# EasyEDA Pro project 2轴4.0--(02-06).eprj, schematic 2轴4.0-
Board Name: 2轴4.0-; Create Date: 2025-02-05; Page Name: 2轴4.0-; Project Name: 2轴4.0--0206; Schematic Name: 2轴4.0-; Update Date: 2025-02-06; Company: 嘉立创EDA; Page Size: A2; Version: V1.0
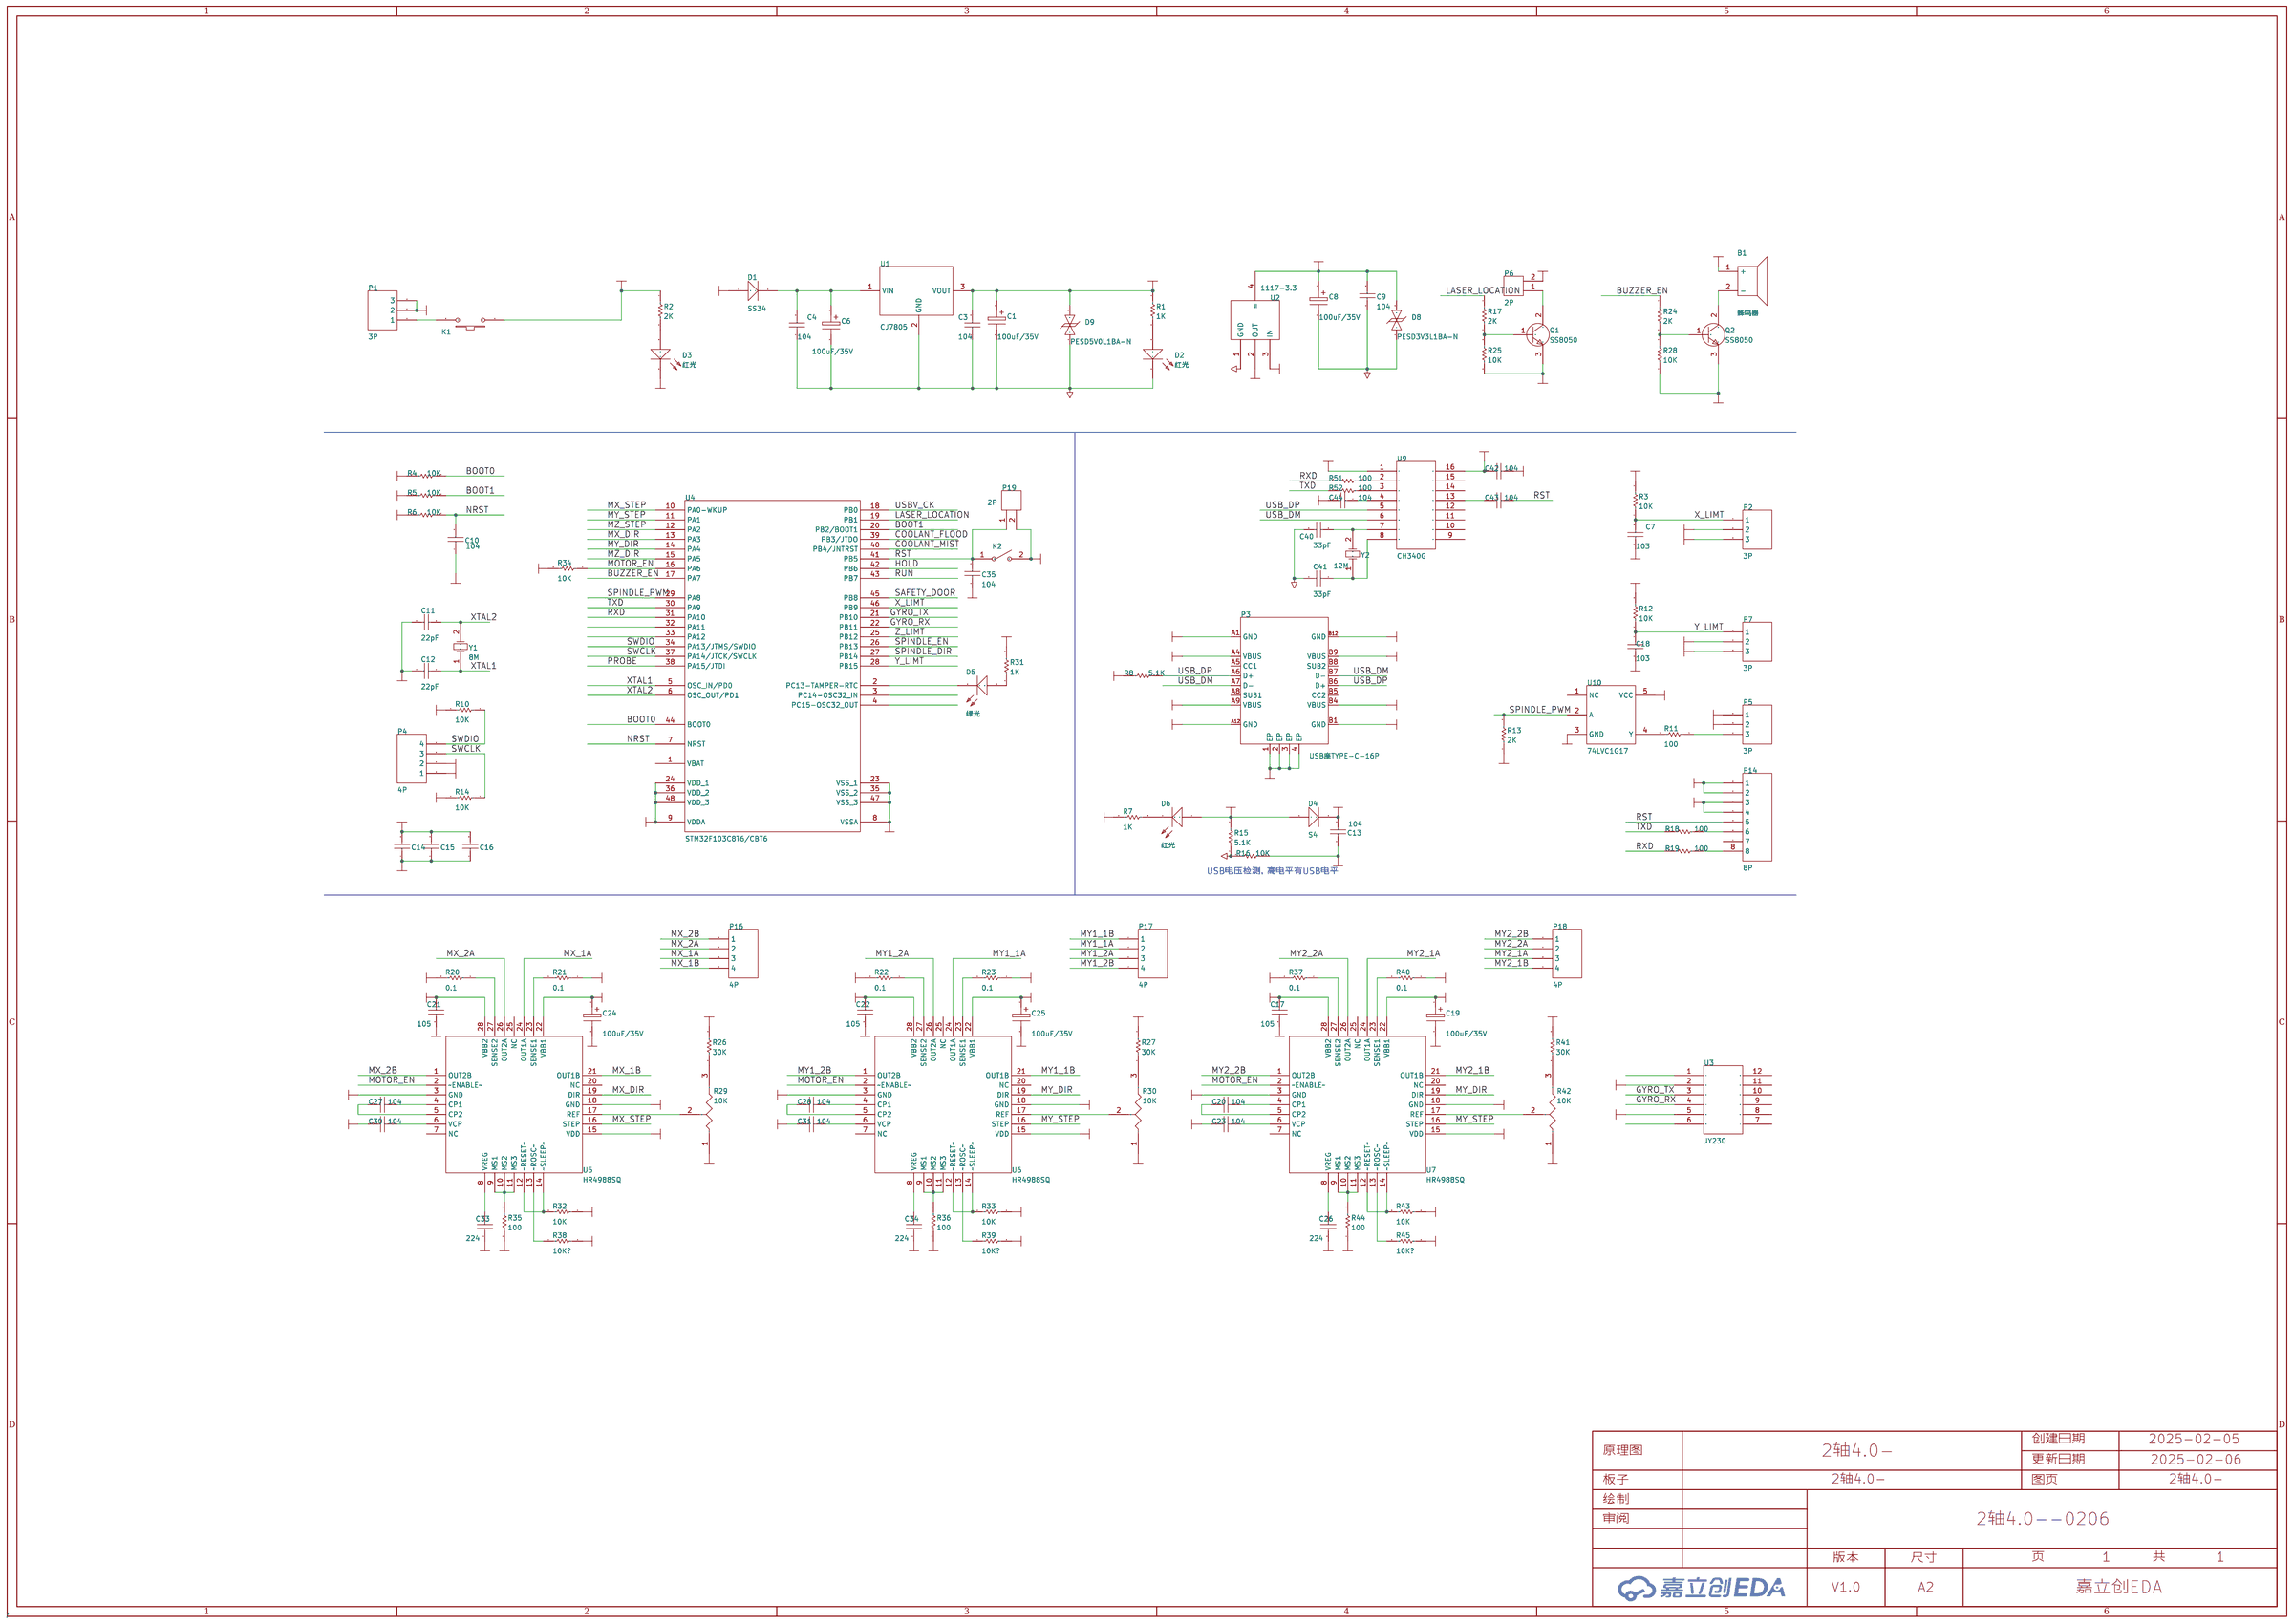
[diagram p0: schematic sheet]

## Parts
B1  蜂鸣器  [蜂鸣器9]
C1  100uF/35V  [电解电容贴片6X6]
C3  104  [0603C]
C4  104  [0603C]
C6  100uF/35V  [电解电容贴片6X6]
C7  103  [0603C]
C8  100uF/35V  [电解电容贴片6X6]
C9  104  [0603C]
C10  104  [0603C]
C11  100pF  [0603C]
C12  100pF  [0603C]
C13  104  [0603C]
C14  104  [0603C]
C15  104  [0603C]
C16  104  [0603C]
C17  105  [0805C]
C18  103  [0603C]
C19  100uF/35V  [电解电容贴片6X6]
C20  104  [0603C]
C21  105  [0805C]
C22  105  [0805C]
C23  104  [0603C]
C24  100uF/35V  [电解电容贴片6X6]
C25  100uF/35V  [电解电容贴片6X6]
C26  224  [0603C]
C27  104  [0603C]
C28  104  [0603C]
C30  104  [0603C]
C31  104  [0603C]
C33  224  [0603C]
C34  224  [0603C]
C35  104  [0603C]
C40  18pF  [0603C]
C41  18pF  [0603C]
C42  104  [0603C]
C43  104  [0603C]
C44  104  [0603C]
D1  SS34  [SMA]
D2  红光  [0603LED]
D3  红光  [0603LED]
D4  S4  [SOD-123]
D5  绿光  [0603LED]
D6  红光  [0603LED]
D8  PESD3V3L1BA-N  [SOD-523_L1.2-W0.8-LS1.6-BI]
D9  PESD5V0L1BA-N  [SOD-523_L1.2-W0.8-LS1.6-BI]
K1  按键  [按键18X13]
K2  开关  [按键6X6贴片]
P1  3P  [DC0044A]
P2  3P  [HDR1X3_P]
P3  USB座TYPE-C-16P  [USB-TYPE-C-16P]
P4  4P  [SIP4]
P5  3P  [HDR1X3_P]
P6  2P  [HDR1X2_P]
P7  3P  [HDR1X3_P]
P14  8P  [IDC8弯脚]
P16  4P  [HDR1X4_P]
P17  4P  [HDR1X4_P]
P18  4P  [HDR1X4_P]
P19  2P  [HDR1X2_P]
Q1  SS8050  [SOT-23]
Q2  SS8050  [SOT-23]
R1  1K  [0603R]
R2  2K  [0603R]
R3  10K  [0603R]
R4  10K  [0603R]
R5  10K  [0603R]
R6  10K  [0603R]
R7  1K  [0603R]
R8  5.1K  [0603R]
R10  10K  [0603R]
R11  100  [0603R]
R12  10K  [0603R]
R13  2K  [0603R]
R14  10K  [0603R]
R15  5.1K  [0603R]
R16  10K  [0603R]
R17  2K  [0603R]
R18  100  [0603R]
R19  100  [0603R]
R20  0.1  [0805R]
R21  0.1  [0805R]
R22  0.1  [0805R]
R23  0.1  [0805R]
R24  2K  [0603R]
R25  10K  [0603R]
R26  30K  [0603R]
R27  30K  [0603R]
R28  10K  [0603R]
R29  10K  [松下贴片电位器3X3]
R30  10K  [松下贴片电位器3X3]
R31  1K  [0603R]
R32  10K  [0603R]
R33  10K  [0603R]
R34  10K  [0603R]
R35  100  [0603R]
R36  100  [0603R]
R37  0.1  [0805R]
R38  10K?  [0603R]
R39  10K?  [0603R]
R40  0.1  [0805R]
R41  30K  [0603R]
R42  10K  [松下贴片电位器3X3]
R43  10K  [0603R]
R44  100  [0603R]
R45  10K?  [0603R]
R51  100  [0603R]
R52  100  [0603R]
U1  CJ7805  [TO-263-2]
U2  1117-3.3  [SOT-223]
U3  JY230  [舵螺仪JY-230]
U4  STM32F103C8T6/CBT6  [LQFP48]
U5  HR4988SQ  [QFN28]
U6  HR4988SQ  [QFN28]
U7  HR4988SQ  [QFN28]
U9  CH340G  [SOP16]
U10  74LVC1G17  [SOT-23-5]
Y1  8M  [晶振贴片]
Y2  12M  [晶振贴片49SSMD]

## Library data of the parts
B1 = 蜂鸣器: Library Name: SCH封装库
C1 C6 C8 C19 C24 C25 = 100uF/35V: Origin Footprint 2: X47U; Origin Footprint 1: 电解电容贴片6x6; Design Item ID: ELECTRO1; Library Name: *
C3 C9 C10 C13 C35 C42-C44 = 104: Capacitor (Semiconductor SIM Model); Published: 8-Jun-2000; LatestRevisionDate: 17-Jul-2002; LatestRevisionNote: Re-released for DXP Platform.; PackageReference: C1206; Publisher: Altium Limited; Origin Footprint 2: C1206; Origin Footprint 3: 0402; Origin Footprint 4: 1310[0504]; Origin Footprint 5: 1608[0603]; Origin Footprint 6: C1210; Origin Footprint 7: C0805; Origin Footprint 8: C1206; Origin Footprint 9: 0805; Origin Footprint 10: 0805L; Origin Footprint 11: 0805C; Design Item ID: Cap Semi; Library Name: Miscellaneous Devices
C4 C14-C16 C20 C23 C27 C28 C30 C31 = 104: Origin Footprint 2: CAP; Origin Footprint 3: 0805C; Design Item ID: CAP; Library Name: SCH封装库
C7 C18 = 103: Design Item ID: CAP; Library Name: SCH封装库
C11 C12 = 22pF: Capacitor (Semiconductor SIM Model); Published: 8-Jun-2000; LatestRevisionDate: 17-Jul-2002; LatestRevisionNote: Re-released for DXP Platform.; PackageReference: C1206; Publisher: Altium Limited; Origin Footprint 2: C1206; Origin Footprint 3: 0402; Origin Footprint 4: 1310[0504]; Origin Footprint 5: 1608[0603]; Origin Footprint 6: C1210; Origin Footprint 7: C0805; Origin Footprint 8: C1206; Origin Footprint 9: 0805; Origin Footprint 10: 0805L; Origin Footprint 11: 0805C; Design Item ID: Cap Semi; Library Name: Miscellaneous Devices
C17 C21 C22 = 105: Design Item ID: CAP; Library Name: SCH封装库
C26 C33 C34 = 224: Design Item ID: CAP; Library Name: SCH封装库
C40 C41 = 33pF: Capacitor (Semiconductor SIM Model); Published: 8-Jun-2000; LatestRevisionDate: 17-Jul-2002; LatestRevisionNote: Re-released for DXP Platform.; PackageReference: C1206; Publisher: Altium Limited; Origin Footprint 2: C1206; Origin Footprint 3: 0402; Origin Footprint 4: 1310[0504]; Origin Footprint 5: 1608[0603]; Origin Footprint 6: C1210; Origin Footprint 7: C0805; Origin Footprint 8: C1206; Origin Footprint 9: 0805; Origin Footprint 10: 0805L; Design Item ID: Cap Semi; Library Name: Miscellaneous Devices
D1 = SS34: Design Item ID: 1N4148; Library Name: SCH封装库
D2 D3 D6 = 红光: Origin Footprint 2: LED(小); Design Item ID: LED; Library Name: SCH封装库
D4 = S4: Design Item ID: 1N4148; Library Name: SCH封装库
D5 = 绿光: Origin Footprint 2: LED(小); Design Item ID: LED; Library Name: SCH封装库
D8 D9 = PESD5V0S1BBN: Supplier Part: C314264; Manufacturer: BORN伯恩半导体; Supplier Footprint: SOD-523; JLCPCB Part Class: Extended Part; Datasheet: https://atta.szlcsc.com/upload/public/pdf/source/20181015/C314264_F9AC5761AC2631DA841FBD1D9C6821E3.pdf; Supplier: LCSC; Polarity: Bidirectional; Voltage - Reverse Standoff (Typ): 5V (Max); Voltage - Breakdown (Min): 6V; Voltage - Clamping (Max) @ Ipp: 15V; Current - Peak Pulse (10/1000μs): 5A (8/20us)
K1 = 按键: Origin Footprint 2: 按键（小）; Origin Footprint 3: 侧立按键; Origin Footprint 1: 按键18x13; Library Name: SCH封装库
K2 = 开关: Library Name: SCH封装库
P1 P2 P5 P7 = 3P: Library Name: SCH封装库
P3 = USB座TYPE-C-16P: Supplier: LCSC; Supplier Part: C709358; Manufacturer: Shenzhen Kinghelm Elec; Manufacturer Part: KH-TYPE-C-16P-T; Library Name: SCH封装库
P4 P16-P18 = 4P: Library Name: SCH封装库
P6 P19 = 2P: Library Name: SCH封装库
P14 = 8P: Library Name: SCH封装库
Q1 Q2 = SS8050: Published: 8-Jun-2000; LatestRevisionDate: 17-Jul-2002; LatestRevisionNote: Re-released for DXP Platform.; PackageReference: TO-226; Publisher: Altium Limited; Code_JEDEC: TO-226-AA; Origin Footprint 2: TO-92; Design Item ID: NPN; Library Name: SCH封装库
R1 R7 R31 = 1K: Resistor; Published: 8-Jun-2000; LatestRevisionDate: 17-Jul-2002; LatestRevisionNote: Re-released for DXP Platform.; PackageReference: AXIAL-0.3; Publisher: Altium Limited; Origin Footprint 2: AXIAL-0.3; Origin Footprint 3: R0805; Origin Footprint 4: 0805R; Design Item ID: RES; Library Name: SCH封装库
R2 R13 R17 R24 = 2K: Resistor; Published: 8-Jun-2000; LatestRevisionDate: 17-Jul-2002; LatestRevisionNote: Re-released for DXP Platform.; PackageReference: AXIAL-0.3; Publisher: Altium Limited; Origin Footprint 2: AXIAL-0.3; Origin Footprint 3: R0805; Origin Footprint 4: 0805R; Design Item ID: RES; Library Name: SCH封装库
R3 R12 R16 R25 R28 R32-R34 R43 = 10K: Resistor; Published: 8-Jun-2000; LatestRevisionDate: 17-Jul-2002; LatestRevisionNote: Re-released for DXP Platform.; PackageReference: AXIAL-0.3; Publisher: Altium Limited; Origin Footprint 2: AXIAL-0.3; Origin Footprint 3: R0805; Origin Footprint 4: 0805R; Design Item ID: RES; Library Name: SCH封装库
R4-R6 R10 R14 = 10K: Resistor; Published: 8-Jun-2000; LatestRevisionDate: 17-Jul-2002; LatestRevisionNote: Re-released for DXP Platform.; PackageReference: AXIAL-0.3; Publisher: Altium Limited; Origin Footprint 2: AXIAL-0.3; Origin Footprint 3: 0805R; Origin Footprint 4: 0805R; Design Item ID: RES; Library Name: SCH封装库
R8 = 5.1K: Resistor; Published: 8-Jun-2000; LatestRevisionDate: 17-Jul-2002; LatestRevisionNote: Re-released for DXP Platform.; PackageReference: AXIAL-0.3; Publisher: Altium Limited; Origin Footprint 2: AXIAL-0.3; Origin Footprint 3: R0805; Design Item ID: RES; Library Name: SCH封装库
R11 R18 R19 R35 R36 R44 R51 R52 = 100: Resistor; Published: 8-Jun-2000; LatestRevisionDate: 17-Jul-2002; LatestRevisionNote: Re-released for DXP Platform.; PackageReference: AXIAL-0.3; Publisher: Altium Limited; Origin Footprint 2: AXIAL-0.3; Origin Footprint 3: R0805; Origin Footprint 4: 0805R; Design Item ID: RES; Library Name: SCH封装库
R15 = 5.1K: Resistor; Published: 8-Jun-2000; LatestRevisionDate: 17-Jul-2002; LatestRevisionNote: Re-released for DXP Platform.; PackageReference: AXIAL-0.3; Publisher: Altium Limited; Origin Footprint 2: AXIAL-0.3; Origin Footprint 3: R0805; Origin Footprint 4: 0805R; Design Item ID: RES; Library Name: SCH封装库
R20-R23 R37 R40 = 0.1: Resistor; Published: 8-Jun-2000; LatestRevisionDate: 17-Jul-2002; LatestRevisionNote: Re-released for DXP Platform.; PackageReference: AXIAL-0.3; Publisher: Altium Limited; Origin Footprint 2: AXIAL-0.3; Origin Footprint 3: R0805; Origin Footprint 4: 0603R; Design Item ID: RES; Library Name: SCH封装库
R26 R27 R41 = 30K: Resistor; Published: 8-Jun-2000; LatestRevisionDate: 17-Jul-2002; LatestRevisionNote: Re-released for DXP Platform.; PackageReference: AXIAL-0.3; Publisher: Altium Limited; Origin Footprint 2: AXIAL-0.3; Origin Footprint 3: R0805; Origin Footprint 4: 0805R; Design Item ID: RES; Library Name: SCH封装库
R29 R30 R42 = 10K: Design Item ID: 电位器; Library Name: SCH封装库
R38 R39 R45 = 10K?: Resistor; Published: 8-Jun-2000; LatestRevisionDate: 17-Jul-2002; LatestRevisionNote: Re-released for DXP Platform.; PackageReference: AXIAL-0.3; Publisher: Altium Limited; Origin Footprint 2: AXIAL-0.3; Origin Footprint 3: R0805; Design Item ID: RES; Library Name: SCH封装库
U1 = CJ7805: Design Item ID: 7805; Library Name: SCH封装库
U2 = 1117-3.3: Design Item ID: LM1117; Library Name: Party600
U3 = JY230: Design Item ID: DIP12; Library Name: SCH封装库
U4 = STM32F103C8T6/CBT6: STM32 ARM-based 32-bit MCU with 32 Kbytes Flash, 48-pin LQFP, Industrial Temperature; Published: *; DatasheetVersion: *; PackageVersion: *; PackageReference: *; Publisher: *; PackageDescription: *; ComponentLink1Description: *; ComponentLink1URL: *; ComponentLink2Description: *; ComponentLink2URL: *; Origin Footprint 2: LQFP48_L; Origin Footprint 3: LQFP48_M; Design Item ID: STM32F103C6T6; Library Name: ST Microcontroller 32-Bit STM32 SCH
U5-U7 = HR4988SQ: Design Item ID: HR4988; Library Name: SCH封装库
U9 = CH340G: Design Item ID: DIP16; Library Name: SCH封装库
U10 = 74LVC1G17: Library Name: SCH封装库
Y1 = 8M: Crystal Oscillator; Published: 8-Jun-2000; LatestRevisionDate: 17-Jul-2002; LatestRevisionNote: Re-released for DXP Platform.; PackageReference: R38; Publisher: Altium Limited; Origin Footprint 2: R38; Origin Footprint 3: XTAL-49S; Design Item ID: XTAL; Library Name: Miscellaneous Devices
Y2 = 12M: Crystal Oscillator; Published: 8-Jun-2000; LatestRevisionDate: 17-Jul-2002; LatestRevisionNote: Re-released for DXP Platform.; PackageReference: R38; Publisher: Altium Limited; Origin Footprint 2: R38; Origin Footprint 3: XTAL-49S; Design Item ID: XTAL; Library Name: Miscellaneous Devices

## Nets
3V3: C8.1 C9.2 C14.2 C15.2 C16.2 D8.2 P4.2 R6.1 R8.1 R10.2 R14.2 R31.2 R34.2 U2.2(OUT) U2.4(=) U3.2 U4.9(VDDA) U4.24(VDD_1) U4.36(VDD_2) U4.48(VDD_3)
12V: C17.1 C19.1 C21.1 C22.1 C23.2 C24.1 C25.1 C30.2 C31.2 D1.1 K1.1 P5.1 R2.1 U5.22(VBB1) U5.28(VBB2) U6.22(VBB1) U6.28(VBB2) U7.22(VBB1) U7.28(VBB2)
GND: C1.2 C3.1 C4.1 C6.2 C7.1 C8.2 C9.1 C10.1 C11.2 C12.2 C13.1 C14.1 C15.1 C16.1 C17.2 C18.1 C19.2 C21.2 C22.2 C24.2 C25.2 C26.2 C33.2 C34.2 C35.2 C40.2 C41.2 C42.2 C44.2 D2.2 D3.2 D8.1 D9.1 K2.2(NO) P1.2 P1.3 P2.2 P3.1(EP) P3.2(EP) P3.3(EP) P3.4(EP) P3.A1(GND) P3.A12(GND) P3.B1(GND) P3.B12(GND) P4.1 P5.2 P7.2 P14.3 P14.4 P19.2 Q1.3(E) Q2.3(E) R4.1 R5.1 R7.1 R13.1 R16.1 R20.2 R21.1 R22.2 R23.1 R25.1 R28.1 R29.1(A) R30.1(A) R37.2 R38.2 R39.2 R40.1 R42.1(A) R45.2 U1.2(GND) U2.1(GND) U3.5 U4.8(VSSA) U4.23(VSS_1) U4.35(VSS_2) U4.47(VSS_3) U5.3(GND) U5.18(GND) U6.3(GND) U6.18(GND) U7.3(GND) U7.18(GND) U9.1 U10.3(GND)
VCC: B1.1(+) C1.1 C3.2 C13.2 D4.2 D9.2 P2.3 P6.2 P7.3 P14.1 P14.2 R1.1 R3.2 R12.2 R26.2 R27.2 R32.1 R33.1 R35.1 R36.1 R41.2 R43.1 R44.1 U1.3(VOUT) U2.3(IN) U5.15(VDD) U6.15(VDD) U7.15(VDD) U10.5(VCC)
BOOT0: R4.2 U4.44(BOOT0)
BOOT1: R5.2 U4.20(PB2/BOOT1)
BUZZER_EN: R24.1 U4.17(PA7)
COOLANT_FLOOD: U4.39(PB3/JTDO)
COOLANT_MIST: U4.40(PB4/JNTRST)
GYRO_RX: U3.4 U4.22(PB11)
GYRO_TX: U3.3 U4.21(PB10)
HOLD: U4.42(PB6)
LASER_LOCATION: R17.1 U4.19(PB1)
MOTOR_EN: R34.1 U4.16(PA6) U5.2(~ENABLE~) U6.2(~ENABLE~) U7.2(~ENABLE~)
MX_1A: P16.3 U5.24(OUT1A)
MX_1B: P16.4 U5.21(OUT1B)
MX_2A: P16.2 U5.26(OUT2A)
MX_2B: P16.1 U5.1(OUT2B)
MX_DIR: U4.13(PA3) U5.19(DIR)
MX_STEP: U4.10(PA0-WKUP) U5.16(STEP)
MY1_1A: P17.2 U6.24(OUT1A)
MY1_1B: P17.1 U6.21(OUT1B)
MY1_2A: P17.3 U6.26(OUT2A)
MY1_2B: P17.4 U6.1(OUT2B)
MY2_1A: P18.3 U7.24(OUT1A)
MY2_1B: P18.4 U7.21(OUT1B)
MY2_2A: P18.2 U7.26(OUT2A)
MY2_2B: P18.1 U7.1(OUT2B)
MY_DIR: U4.14(PA4) U6.19(DIR) U7.19(DIR)
MY_STEP: U4.11(PA1) U6.16(STEP) U7.16(STEP)
MZ_DIR: U4.15(PA5)
MZ_STEP: U4.12(PA2)
NRST: C10.2 R6.2 U4.7(NRST)
PROBE: U4.38(PA15/JTDI)
RST: C35.1 C43.2 K2.1(COMMON) P14.5 P19.1 U4.41(PB5)
RUN: U4.43(PB7)
RXD: R19.1 R51.2 U4.31(PA10)
SAFETY_DOOR: U4.45(PB8)
SPINDLE_DIR: U4.27(PB14)
SPINDLE_EN: U4.26(PB13)
SPINDLE_PWM: R13.2 U4.29(PA8) U10.2(A)
SWCLK: P4.3 R14.1 U4.37(PA14/JTCK/SWCLK)
SWDIO: P4.4 R10.1 U4.34(PA13/JTMS/SWDIO)
TXD: R18.1 R52.2 U4.30(PA9)
USB_DM: P3.A7(D-) P3.B7(D-) U9.6
USB_DP: P3.A6(D+) P3.B6(D+) R8.2 U9.5
USBV_CK: R15.1 R16.2 U4.18(PB0)
VUSB: C42.1 D4.1 D6.1 P3.A4(VBUS) P3.A9(VBUS) P3.B4(VBUS) P3.B9(VBUS) R15.2 U9.16
X_LIMT: C7.2 P2.1 R3.1 U4.46(PB9)
XTAL1: C12.1 U4.5(OSC_IN/PD0) Y1.1(OSC1)
XTAL2: C11.1 U4.6(OSC_OUT/PD1) Y1.2(OSC2)
Y_LIMT: C18.2 P7.1 R12.1 U4.28(PB15)
Z_LIMT: U4.25(PB12)
Net-(B1-2): B1.2(-) Q2.2(C)
Net-(C4-2): C4.2 C6.1 D1.2 U1.1(VIN)
Net-(C20-1): C20.1 U7.4(CP1)
Net-(C20-2): C20.2 U7.5(CP2)
Net-(C23-1): C23.1 U7.6(VCP)
Net-(C26-1): C26.1 U7.8(VREG)
Net-(C27-1): C27.1 U5.4(CP1)
Net-(C27-2): C27.2 U5.5(CP2)
Net-(C28-1): C28.1 U6.4(CP1)
Net-(C28-2): C28.2 U6.5(CP2)
Net-(C30-1): C30.1 U5.6(VCP)
Net-(C31-1): C31.1 U6.6(VCP)
Net-(C33-1): C33.1 U5.8(VREG)
Net-(C34-1): C34.1 U6.8(VREG)
Net-(C40-1): C40.1 U9.7 Y2.2(OSC2)
Net-(C41-1): C41.1 U9.8 Y2.1(OSC1)
Net-(C43-1): C43.1 U9.13
Net-(C44-1): C44.1 U9.4
Net-(D2-1): D2.1 R1.2
Net-(D3-1): D3.1 R2.2
Net-(D5-1): D5.1 R31.1
Net-(D5-2): D5.2 U4.2(PC13-TAMPER-RTC)
Net-(D6-2): D6.2 R7.2
Net-(K1-2): K1.2 P1.1
Net-(P5-3): P5.3 R11.2
Net-(P6-1): P6.1 Q1.2(C)
Net-(P14-6): P14.6 R18.2
Net-(P14-8): P14.8 R19.2
Net-(Q1-1): Q1.1(B) R17.2 R25.2
Net-(Q2-1): Q2.1(B) R24.2 R28.2
Net-(R11-1): R11.1 U10.4(Y)
Net-(R20-1): R20.1 U5.27(SENSE2)
Net-(R21-2): R21.2 U5.23(SENSE1)
Net-(R22-1): R22.1 U6.27(SENSE2)
Net-(R23-2): R23.2 U6.23(SENSE1)
Net-(R26-1): R26.1 R29.3(B)
Net-(R27-1): R27.1 R30.3(B)
Net-(R29-2): R29.2(TAP) U5.17(REF)
Net-(R30-2): R30.2(TAP) U6.17(REF)
Net-(R32-2): R32.2 U5.12(~RESET~) U5.14(~SLEEP~)
Net-(R33-2): R33.2 U6.12(~RESET~) U6.14(~SLEEP~)
Net-(R35-2): R35.2 U5.9(MS1) U5.10(MS2) U5.11(MS3)
Net-(R36-2): R36.2 U6.9(MS1) U6.10(MS2) U6.11(MS3)
Net-(R37-1): R37.1 U7.27(SENSE2)
Net-(R38-1): R38.1 U5.13(~ROSC~)
Net-(R39-1): R39.1 U6.13(~ROSC~)
Net-(R40-2): R40.2 U7.23(SENSE1)
Net-(R41-1): R41.1 R42.3(B)
Net-(R42-2): R42.2(TAP) U7.17(REF)
Net-(R43-2): R43.2 U7.12(~RESET~) U7.14(~SLEEP~)
Net-(R44-2): R44.2 U7.9(MS1) U7.10(MS2) U7.11(MS3)
Net-(R45-1): R45.1 U7.13(~ROSC~)
Net-(R51-1): R51.1 U9.2
Net-(R52-1): R52.1 U9.3

Not connected (* = marked no-connect by the designer): P3 A5(CC1) A8(SUB1) B5(CC2) B8(SUB2); P14 7; U3 1 6 7 8 9 10 11 12; U4 1(VBAT) 3(PC14-OSC32_IN) 4(PC15-OSC32_OUT) 32(PA11) 33(PA12); U5 7(NC) 20(NC) 25(NC); U6 7(NC) 20(NC) 25(NC); U7 7(NC) 20(NC) 25(NC); U9 9 10 11 12 14 15; U10 1(NC)

## Notes on the sheet
- USB电压检测，高电平有USB电平
